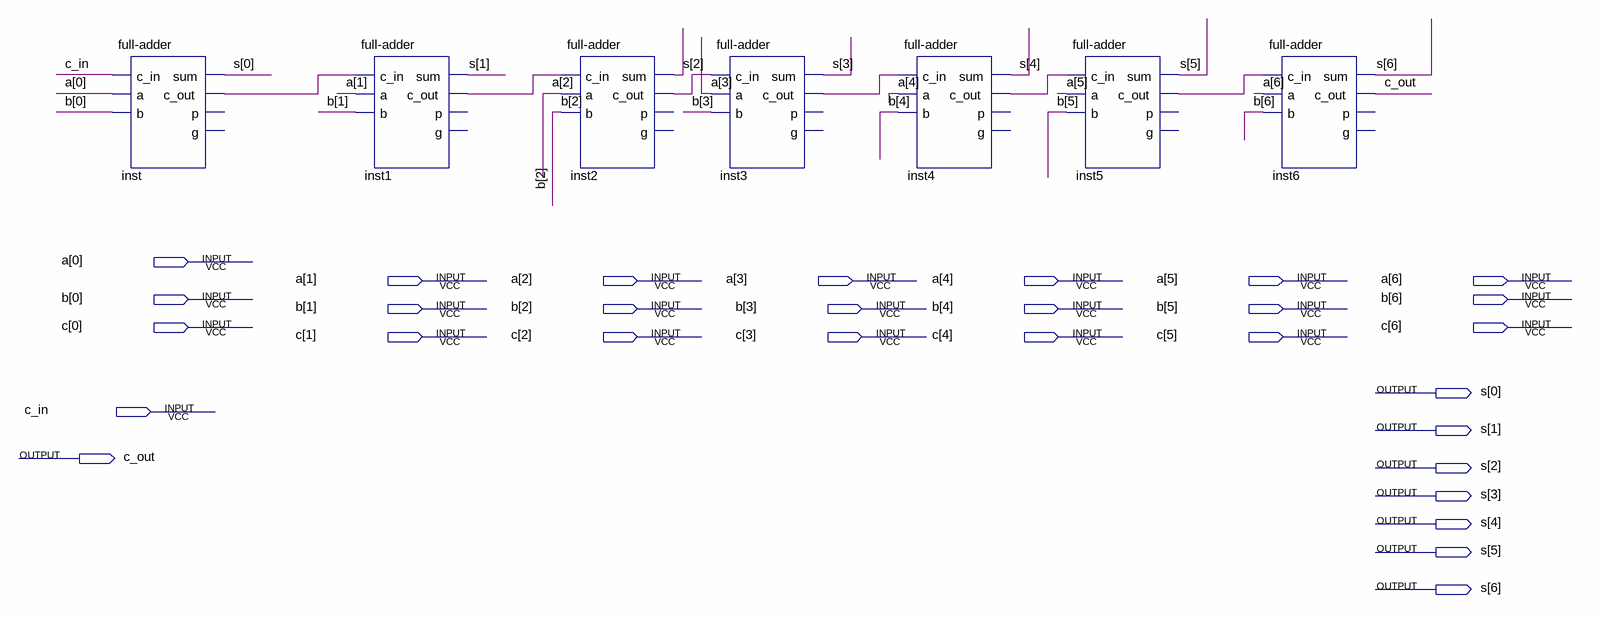
[diagram p0: schematic sheet]
// Quartus schematic Ripple_Carry7.bdf as structural Verilog: 7 symbols, 30 pins
module Ripple_Carry7 (
  input  [6:0] a,
  input  [6:0] b,
  input  [6:0] c,
  input  c_in,
  output [6:0] s,
  output c_out
);

  wire inst1_c_out, inst2_c_out, inst3_c_out, inst4_c_out, inst5_c_out, inst_c_out;

  \full-adder  inst (.c_in(c_in), .a(a[0]), .b(b[0]), .sum(s[0]), .c_out(inst_c_out));  // open: p, g
  \full-adder  inst1 (.c_in(inst_c_out), .a(a[1]), .b(b[1]), .sum(s[1]), .c_out(inst1_c_out));  // open: p, g
  \full-adder  inst2 (.c_in(inst1_c_out), .a(a[2]), .b(b[2]), .sum(s[2]), .c_out(inst2_c_out));  // open: p, g
  \full-adder  inst3 (.c_in(inst2_c_out), .a(a[3]), .b(b[3]), .sum(s[3]), .c_out(inst3_c_out));  // open: p, g
  \full-adder  inst4 (.c_in(inst3_c_out), .a(a[4]), .b(b[4]), .sum(s[4]), .c_out(inst4_c_out));  // open: p, g
  \full-adder  inst5 (.c_in(inst4_c_out), .a(a[5]), .b(b[5]), .sum(s[5]), .c_out(inst5_c_out));  // open: p, g
  \full-adder  inst6 (.c_in(inst5_c_out), .a(a[6]), .b(b[6]), .sum(s[6]), .c_out(c_out));  // open: p, g
endmodule
